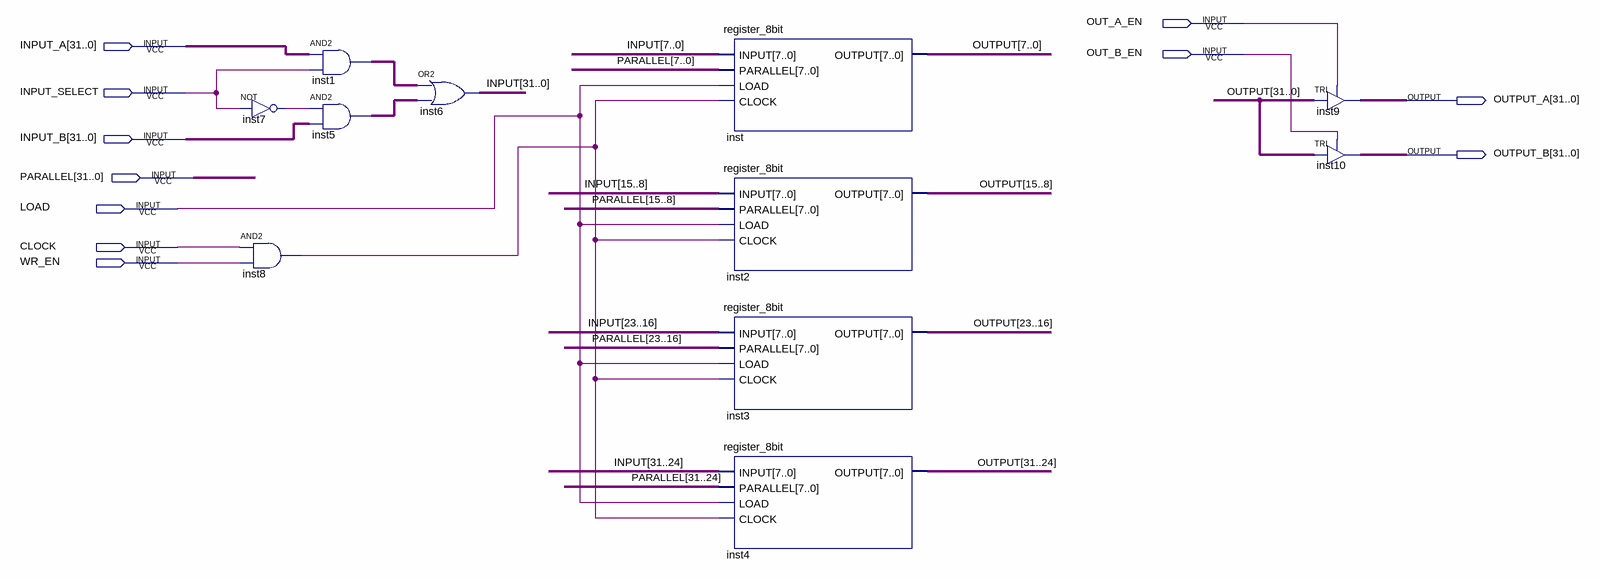
[diagram p0: schematic sheet]
// Quartus schematic register_32bit.bdf as structural Verilog: 11 symbols, 11 pins
module register_32bit (
  input  OUT_A_EN,
  input  [31:0] INPUT_A,
  input  OUT_B_EN,
  input  INPUT_SELECT,
  input  [31:0] INPUT_B,
  input  [31:0] PARALLEL,
  input  LOAD,
  input  CLOCK,
  input  WR_EN,
  output [31:0] OUTPUT_A,
  output [31:0] OUTPUT_B
);

  wire inst7_out, inst8_out;
  wire [31:0] INPUT, inst1_out, inst5_out, OUTPUT;

  not inst7 (inst7_out, INPUT_SELECT);
  and inst8 (inst8_out, CLOCK, WR_EN);
  assign inst1_out = INPUT_A & {32{INPUT_SELECT}};  // AND2 inst1, 32 bits wide
  assign inst5_out = {32{inst7_out}} & INPUT_B;  // AND2 inst5, 32 bits wide
  assign INPUT = inst1_out | inst5_out;  // OR2 inst6, 32 bits wide
  register_8bit inst (
    .INPUT(INPUT[7:0]), .PARALLEL(PARALLEL[7:0]), .LOAD(LOAD), .CLOCK(inst8_out), .OUTPUT(OUTPUT[7:0]));
  register_8bit inst2 (
    .INPUT(INPUT[15:8]), .PARALLEL(PARALLEL[15:8]), .LOAD(LOAD), .CLOCK(inst8_out), .OUTPUT(OUTPUT[15:8]));
  register_8bit inst3 (
    .INPUT(INPUT[23:16]), .PARALLEL(PARALLEL[23:16]), .LOAD(LOAD), .CLOCK(inst8_out), .OUTPUT(OUTPUT[23:16]));
  register_8bit inst4 (
    .INPUT(INPUT[31:24]), .PARALLEL(PARALLEL[31:24]), .LOAD(LOAD), .CLOCK(inst8_out), .OUTPUT(OUTPUT[31:24]));
  TRI inst9[31:0] (.IN(OUTPUT), .OE(OUT_A_EN), .OUT(OUTPUT_A));
  TRI inst10[31:0] (.IN(OUTPUT), .OE(OUT_B_EN), .OUT(OUTPUT_B));
endmodule
